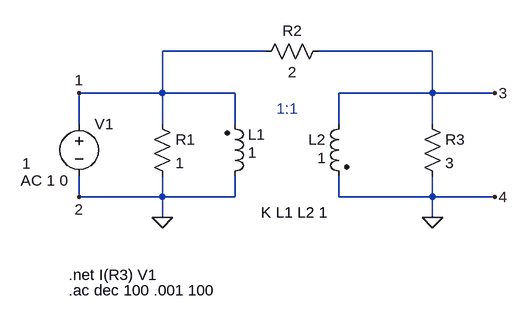
[diagram p0: schematic Punto1.asc]
Punto1.asc, the LTspice schematic file:
Version 4
SHEET 1 896 680
WIRE 416 32 256 32
WIRE 672 32 496 32
WIRE 256 96 256 32
WIRE 256 96 128 96
WIRE 368 96 256 96
WIRE 672 96 672 32
WIRE 672 96 528 96
WIRE 768 96 672 96
WIRE 128 144 128 96
WIRE 256 144 256 96
WIRE 368 144 368 96
WIRE 528 144 528 96
WIRE 672 144 672 96
WIRE 128 256 128 224
WIRE 256 256 256 224
WIRE 256 256 128 256
WIRE 368 256 368 224
WIRE 368 256 256 256
WIRE 528 256 528 224
WIRE 672 256 672 224
WIRE 672 256 528 256
WIRE 768 256 672 256
WIRE 256 288 256 256
WIRE 672 288 672 256
FLAG 128 96 1
FLAG 128 256 2
FLAG 768 96 3
FLAG 768 256 4
FLAG 256 288 0
FLAG 672 288 0
SYMBOL voltage 128 128 R0
WINDOW 123 -90 103 Left 2
WINDOW 39 0 0 Left 0
WINDOW 3 -88 77 Left 2
SYMATTR Value2 AC 1 0
SYMATTR InstName V1
SYMATTR Value 1
SYMBOL res 240 128 R0
SYMATTR InstName R1
SYMATTR Value 1
SYMBOL res 512 16 R90
WINDOW 0 0 56 VBottom 2
WINDOW 3 32 56 VTop 2
SYMATTR InstName R2
SYMATTR Value 2
SYMBOL ind2 352 240 M180
WINDOW 0 36 80 Left 2
WINDOW 3 36 52 Left 2
SYMATTR InstName L1
SYMATTR Value 1
SYMBOL ind2 544 128 M0
WINDOW 3 36 68 Left 2
SYMATTR Value 1
SYMATTR InstName L2
SYMBOL res 656 128 R0
SYMATTR InstName R3
SYMATTR Value 3
TEXT 408 280 Left 2 !K L1 L2 1
TEXT 432 120 Left 2 ;1:1
TEXT 112 376 Left 2 !.net I(R3) V1
TEXT 112 400 Left 2 !.ac dec 100 .001 100

The netlist it stands for:
* Punto1.asc
V1 1 0 1 AC 1 0
R1 1 0 1
R2 3 1 2
L1 0 1 1
L2 3 0 1
R3 3 0 3
K L1 L2 1
* 1:1
.net I(R3) V1
.ac dec 100 .001 100
.backanno
.end